# EAGLE design TouchPad_Demo_v2 (EAGLE 7.6.0)

## Sheet 1 of 2
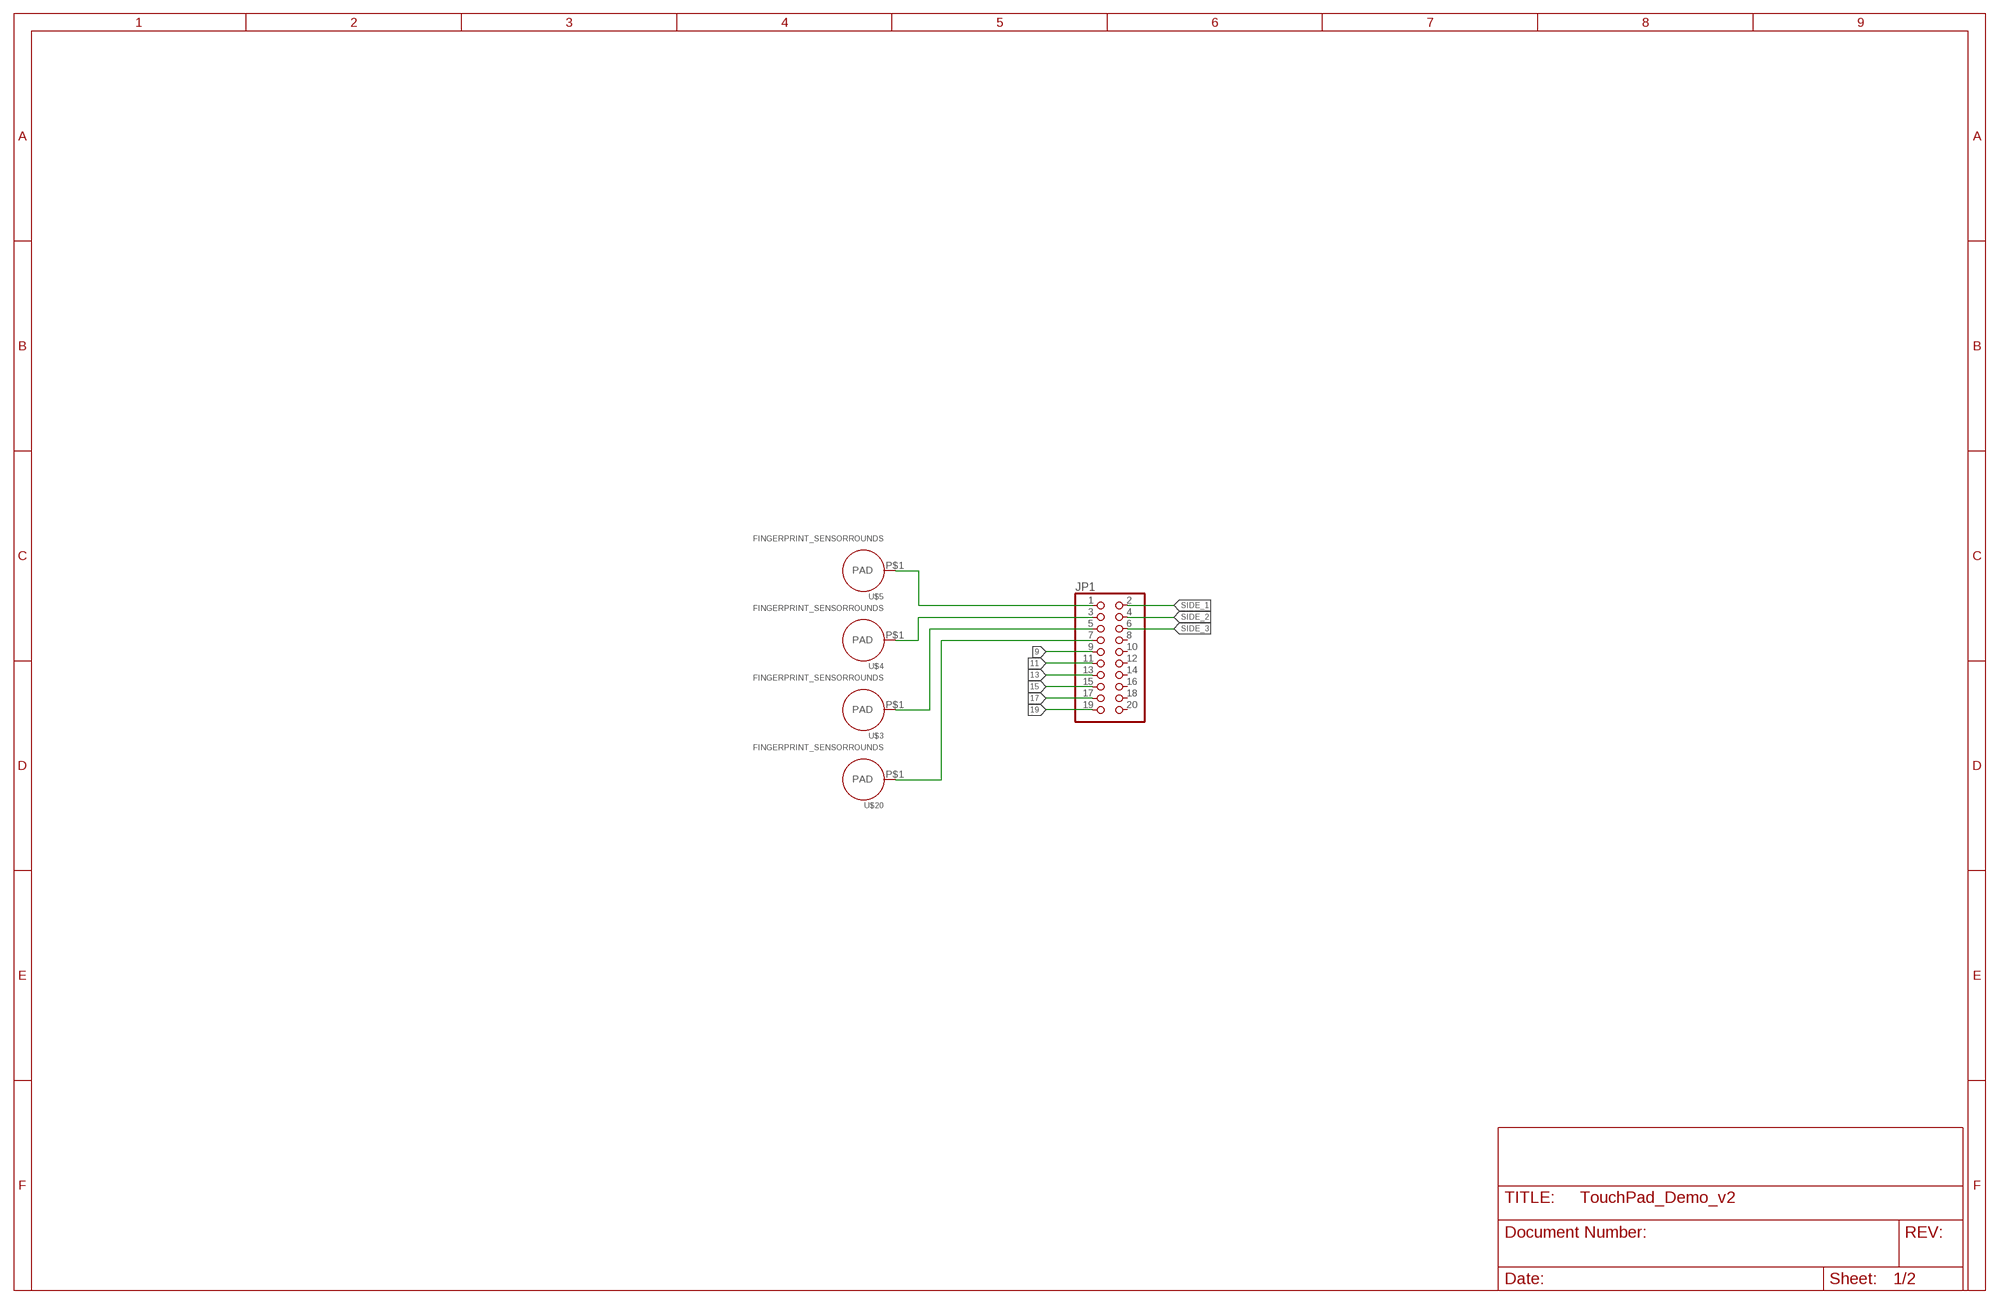
[diagram p0: schematic, sheet 1]

### Parts
JP1  HEADER-2X10MOLEX20_SIDE  [MOLEX20_RIGHTANGLE]
U$3  FINGERPRINT_SENSORROUNDS  [FINGERPRINT_SENSOR_ROUND]
U$4  FINGERPRINT_SENSORROUNDS  [FINGERPRINT_SENSOR_ROUND]
U$5  FINGERPRINT_SENSORROUNDS  [FINGERPRINT_SENSOR_ROUND]
U$20  FINGERPRINT_SENSORROUNDS  [FINGERPRINT_SENSOR_ROUND]

### Nets
9: JP1.9
11: JP1.11
13: JP1.13
15: JP1.15
17: JP1.17
19: JP1.19
N$1: JP1.1 U$5.P$1(PAD)
N$4: JP1.3 U$4.P$1(PAD)
N$9: JP1.5 U$3.P$1(PAD)
N$10: JP1.7 U$20.P$1(PAD)
SIDE_1: JP1.2
SIDE_2: JP1.4
SIDE_3: JP1.6
Unconnected: JP1.8 JP1.10 JP1.12 JP1.14 JP1.16 JP1.18 JP1.20

## Sheet 2 of 2

## Library data of the parts
JP1 = microbuilder:HEADER-2X10: PIN HEADER
U$3-U$5 U$20 = Shockley_Custom:FINGERPRINT_SENSOR

## Board
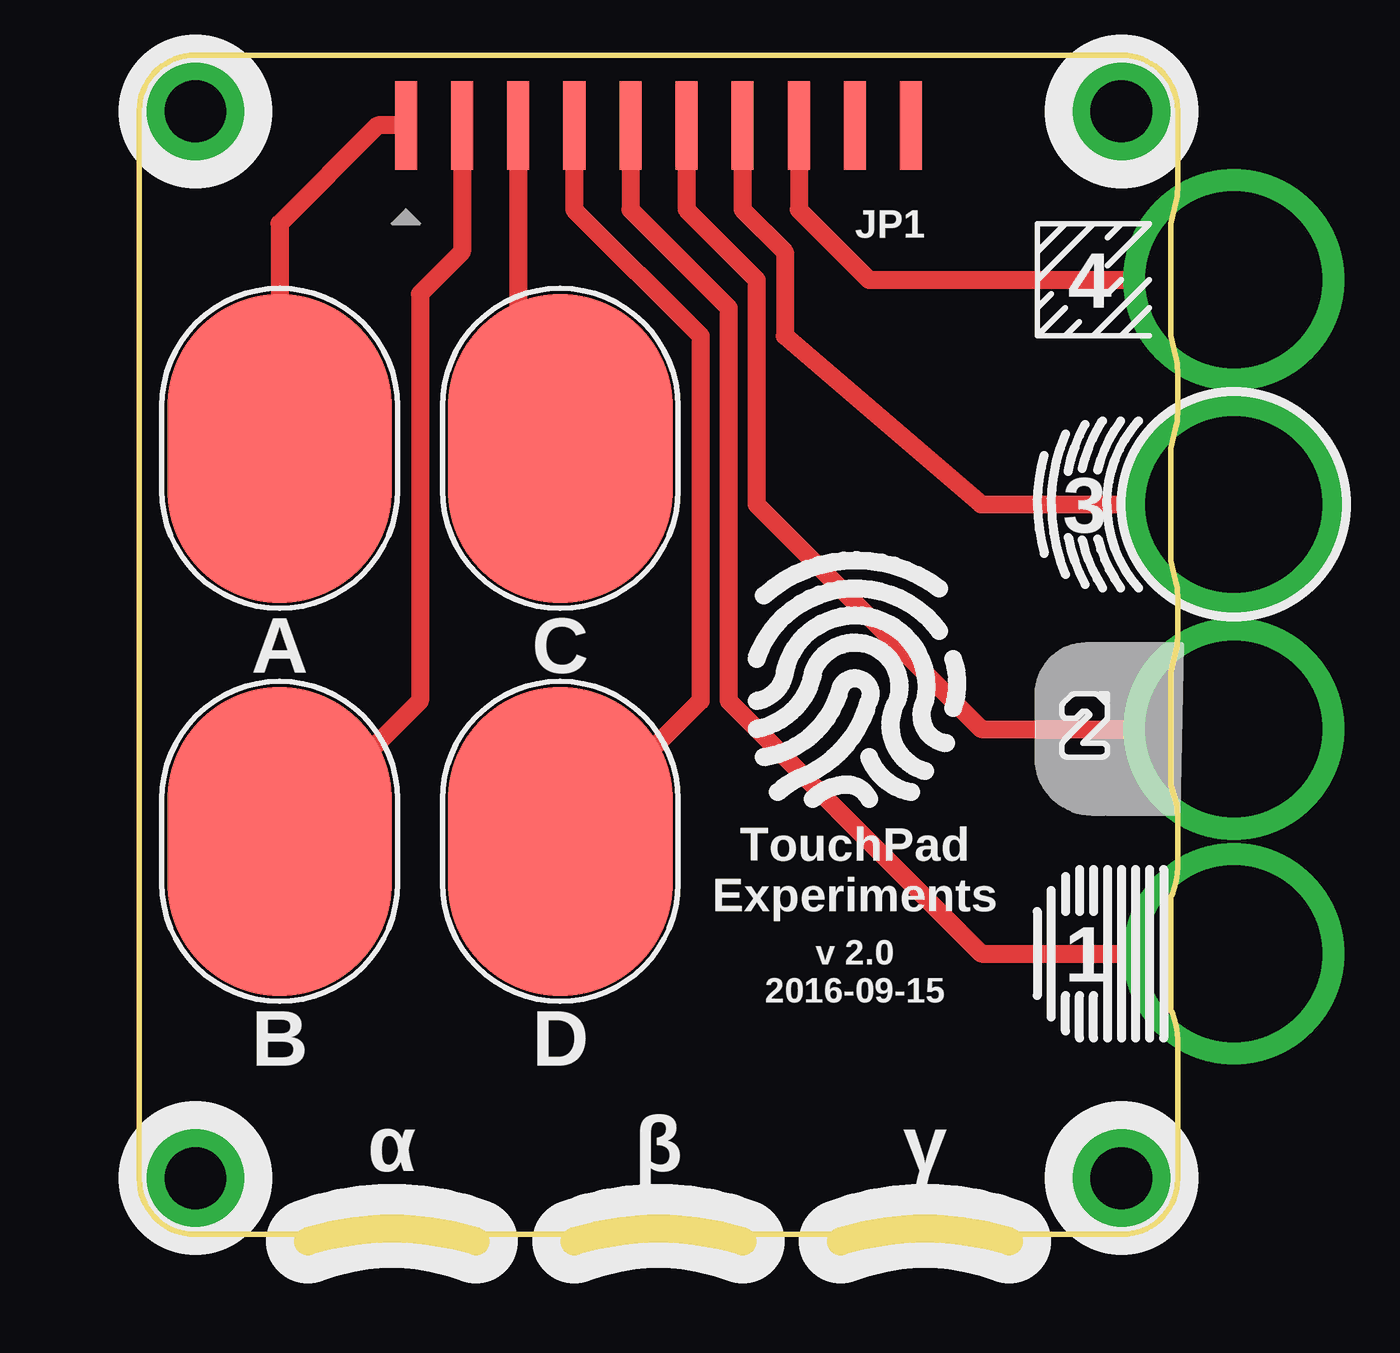
[diagram p1: board, top side]
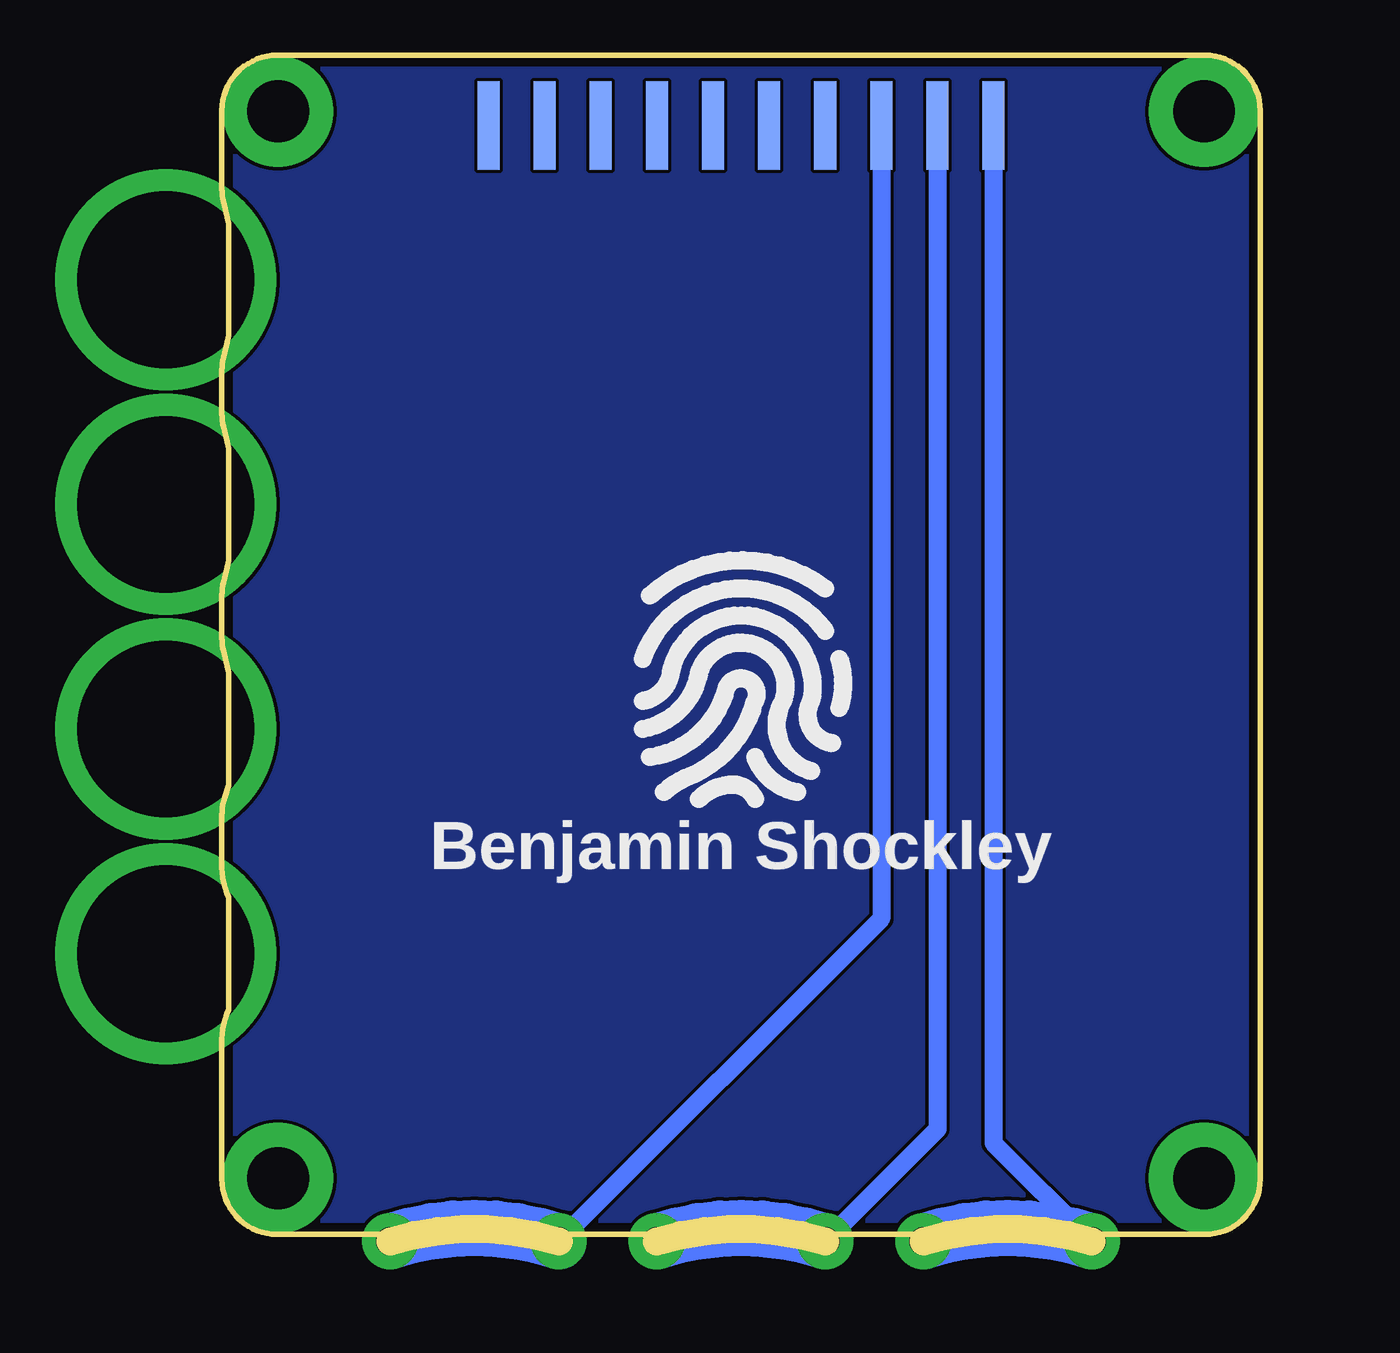
[diagram p2: board, bottom side, seen from below]

Size 46.99 x 53.34 mm. Coordinates in mm from the lower left corner, seen from the top.
Outline: 44.49,0 arc90 46.99,2.5 46.99,8.81 arc27 46.67,10.16 46.67,15.24 arc27 46.99,16.59 46.99,18.96 arc18 46.86,19.75 46.67,20.32 46.67,25.4 46.91,26.37 arc14 46.99,26.98 46.99,28.9 arc14 46.91,29.51 46.67,30.48 46.67,35.56 46.91,36.53 arc14 46.99,37.14 46.99,39.06 arc14 46.91,39.67 46.67,40.64 46.67,45.72 46.91,46.69 arc14 46.99,47.3 46.99,50.84 arc90 44.49,53.34 2.5,53.34 arc90 0,50.84 0,2.57
Outline: 0,2.5 arc90 2.5,0
Outline: 2.54,0 44.45,0
Copper layers (1*16): Top 0.0356mm / dielectric 1.5011mm / Bottom 0.0356mm
Design rules "oshpark-2layer": minimum track width 6mil, minimum drill 13mil, track to track 6mil, track to pad 6mil, pad to pad 6mil, via to via 6mil, smd to smd 6mil, copper to edge 15mil, drill to drill 6mil, minimum pad ring 7mil, minimum via ring 7mil, stop-mask expansion 2.5mil, vias tented up to drill 0mil, thermal gap 10mil
Milling: 3 lines

### Footprints (pad centres in the part's own frame; a part is rotated, then mirrored left to right if it is on the bottom)
MOLEX20_RIGHTANGLE = smd 1 x 4: 1 11.43,0; 3 8.89,0; 5 6.35,0; 7 3.81,0; 9 1.27,0; 11 -1.27,0; 13 -3.81,0; 15 -6.35,0; 17 -8.89,0; 19 -11.43,0 | smd 1 x 4 bottom: 2 11.43,0; 4 8.89,0; 6 6.35,0; 8 3.81,0; 10 1.27,0; 12 -1.27,0; 14 -3.81,0; 16 -6.35,0; 18 -8.89,0; 20 -11.43,0
FINGERPRINT_SENSOR_ROUND = smd 10.16 x 13.97: P$1 0,0

### Placement (x,y rotation side)
JP1  23.5,50.16 180 top
U$1  [FINGERPRINT]  32.38,25.4 0 top
U$3  19.05,35.56 0 top
U$4  6.35,17.78 0 top
U$5  6.35,35.56 0 top
U$19  [FINGERPRINT]  23.5,25.4 0 bottom
U$20  19.05,17.78 0 top

### Tracks (layer width: path | path; a pad name or v marks a point on that pad's centre or on a via)
9  (via drill 8 pad 10)
  Top 0.813: v49.53,12.7 38.1,12.7 26.67,24.13 26.67,41.91 22.23,46.35 JP1.9
11  (via drill 8 pad 10)
  Top 0.813: v49.53,22.86 38.1,22.86 27.94,33.02 27.94,43.18 24.77,46.35 JP1.11
13  (via drill 8 pad 10)
  Top 0.813: v49.53,33.02 38.1,33.02 29.21,40.64 29.21,44.45 27.3,46.35 JP1.13
15  (via drill 8 pad 10)
  Top 0.813: v49.53,43.18 33.02,43.18 29.84,46.35 JP1.15
GND
  pour Bottom: 0,50.84 0,2.5 arc90 2.5,0 44.49,0 arc90 46.99,2.5 46.99,50.84 arc90 44.49,53.34 2.5,53.34 arc90
N$1
  Top 0.813: JP1.1 10.79,50.16 6.35,45.72 U$5.P$1
N$2  (via drill 2.8 pad 5)
  other vias: 2.54,50.8 2.54,2.54 44.45,2.54
N$3  (via drill 2.8 pad 5)
  other vias: 44.45,50.8
N$4
  Top 0.813: JP1.3 14.61,44.45 12.7,42.55 12.7,24.13 U$4.P$1
N$9
  Top 0.813: JP1.5 17.14,35.56 U$3.P$1
N$10
  Top 0.813: JP1.7 19.68,46.35 25.4,40.64 25.4,24.13 U$20.P$1
SIDE_1  (via drill 1.27 pad 2.54)
  Top 2.54: v15.24,-0.32 arc37 v7.62,-0.32
  Bottom 0.813: JP1.2 12.06,4.13 v7.62,-0.32
  Bottom 2.54: v15.24,-0.32 arc37 v7.62,-0.32
SIDE_2  (via drill 1.27 pad 2.54)
  Top 2.54: v27.3,-0.32 arc37 v19.68,-0.32
  Bottom 0.813: JP1.4 14.61,4.76 v19.68,-0.32
  Bottom 2.54: v27.3,-0.32 arc37 v19.68,-0.32
SIDE_3  (via drill 1.27 pad 2.54)
  Top 2.54: v39.37,-0.32 arc37 v31.75,-0.32
  Bottom 0.813: JP1.6 17.14,14.29 v31.75,-0.32
  Bottom 2.54: v39.37,-0.32 arc37 v31.75,-0.32

### Text on the board
tPlace: A | C | TouchPad / Experiments | B | D | v 2.0 / 2016-09-15 | α | β | γ
bPlace: Benjamin Shockley
tNames: 4 | 3 | 1
201bmp: C:/Users/b1457318/Pictures/fingerprint-icon.bmp | C:/Users/b1457318/Pictures/fingerprint-icon.bmp